# Altium schematic sheet Rectifier_shutdown_LT1910.SchDoc
size A
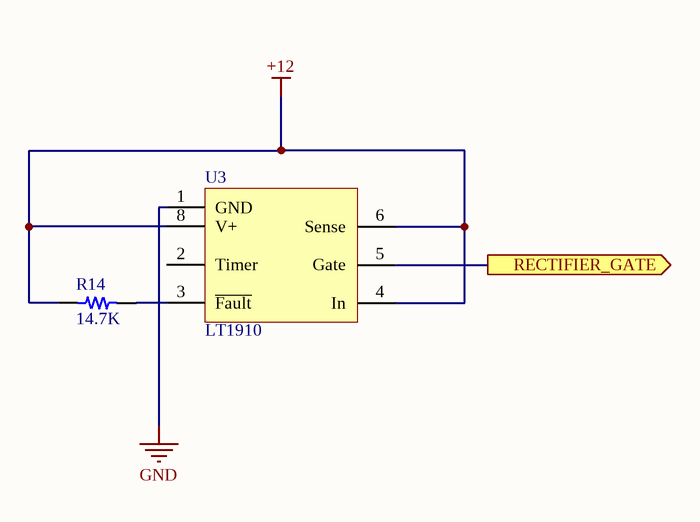
[diagram p0: Rectifier_shutdown_LT1910.SchDoc]

## Parts
R14  value 14.7K  [RES 0805/2012]
U3  LT1910  [SOIC-8]

## Ports
RECTIFIER_GATE (out)

## Nets
+12: R14.1 U3.4(In) U3.6(Sense) U3.8(V+)
GND: U3.1(GND)
RECTIFIER_GATE: U3.5(Gate) ; port RECTIFIER_GATE
NetR14_2: R14.2 U3.3(~{Fault})

Not connected (* = marked no-connect by the designer): U3 2(Timer)

## Library data of the parts
R14 = 2703: Manufacturer_id: 1; idResistor: 2703; Name: Res_14.7K_0805_1/10W_0.5%; Tolerance: 0.5%; Power: 1/10W; Supplier Part Number 1: Digi-Key; Drawer_id: 1; Package: 0805; Link: https://www.digikey.com/product-detail/en/susumu/RR1220P-1472-D-M/RR12P14.7KDCT-ND/1288245; ComponentLink1Description: Datasheet
U3 = 18: Protected High Side MOSFET Driver; Manufacturer_id: 1; idIC_Misc: 18; Name: LT1910 MOSFET Driver; Drawer_id: 1